# EAGLE design NSE2020_2 (EAGLE 9.6.1)
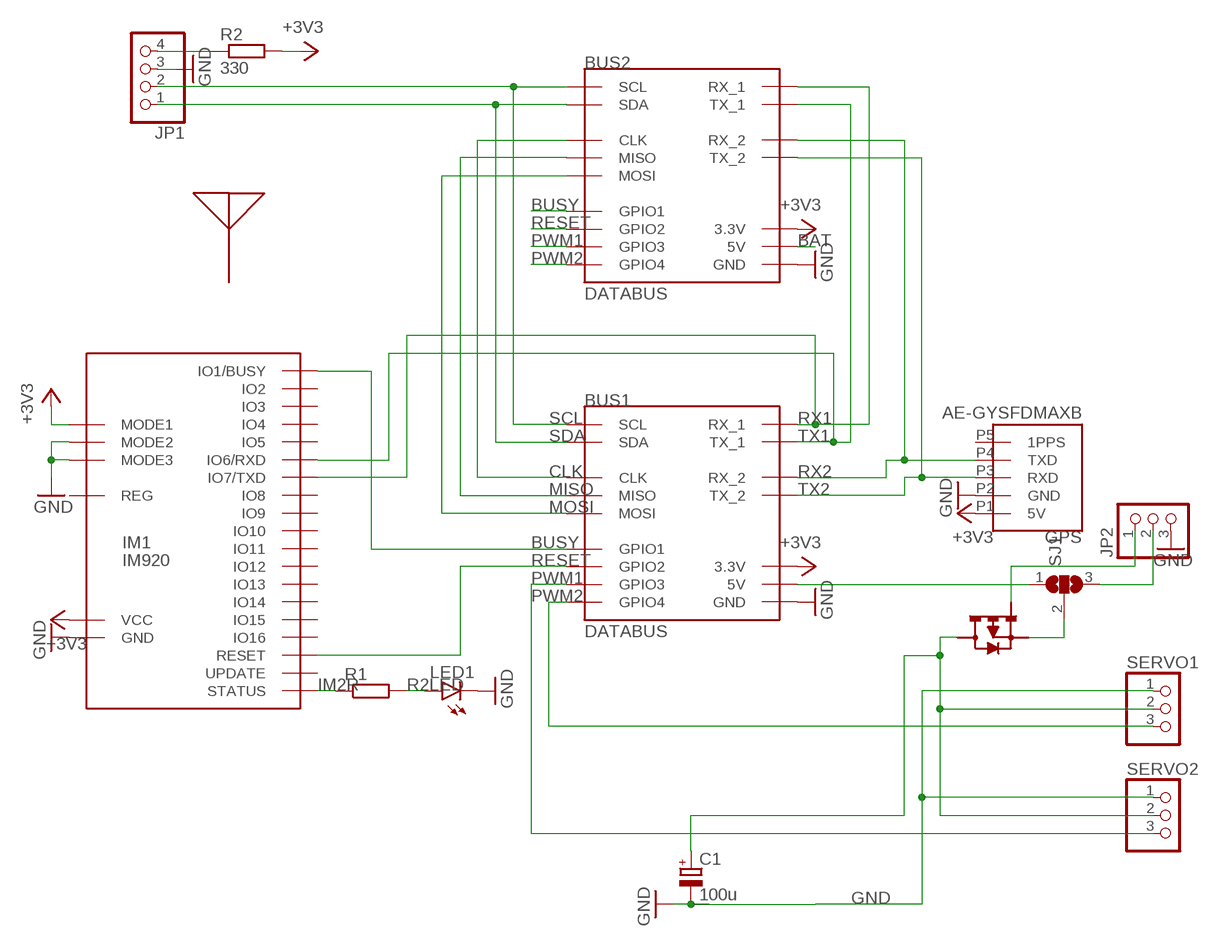
[diagram p0: schematic, sheet 1]

## Parts
ANT1  IM920ANT-XS  [ANTENNA]
BUS1  DATABUS  [8X2]
BUS2  DATABUS  [8X2]
C1  100u  CPOL-EUE2.5-6  [E2,5-6]
GPS  AE-GYSFDMAXB  [AE-GYSFDMAXB]
IM1  IM920  [IM920]
JP1  PINHD-1X4  [1X04]
JP2  PINHD-1X3  [1X03]
LED1  LEDSMT1206  [1206]
R1  R-EU_M2012  [M2012]
R2  330  R-EU_R2012  [R2012]
SERVO1  PINHD-1X3  [1X03]
SERVO2  PINHD-1X3  [1X03]
SJ1  SJ2W  [SJ_2]
U$1  2SJ681  [2SJ681]

## Nets
5V_CELL [PWR]: BUS1.P7(5V) SJ1.1
+3V3 [PWR]: BUS1.P6(3.3V) BUS2.P6(3.3V) GPS.P1(5V) IM1.IO17(MODE1) IM1.IO23(VCC) R2.2
BAT [PWR]: BUS2.P7(5V) C1.+ SERVO1.2 SERVO2.2 U$1.P$2 U$1.P$4
BAT_CELL [PWR]: JP2.2 SJ1.3
BUSY [SGNAL]: BUS1.P3(GPIO1) BUS2.P3(GPIO1) IM1.IO1(IO1/BUSY)
CLK [SGNAL]: BUS1.P1(CLK) BUS2.P1(CLK)
GND [GND]: BUS1.P11(GND) BUS2.P11(GND) C1.- GPS.P2(GND) IM1.IO18(MODE2) IM1.IO19(MODE3) IM1.IO24(GND) JP1.3 JP2.3 LED1.C SERVO1.1 SERVO2.1
IM2R [SGNAL]: IM1.IO21(STATUS) R1.1
MISO [SGNAL]: BUS1.P12(MISO) BUS2.P12(MISO)
MOSI [SGNAL]: BUS1.P2(MOSI) BUS2.P2(MOSI)
N$1 [PWR]: SJ1.2 U$1.P$3
N$2: JP2.1 U$1.P$1
PWM1 [SGNAL]: BUS1.P14(GPIO3) BUS2.P14(GPIO3) SERVO2.3
PWM2 [SGNAL]: BUS1.P15(GPIO4) BUS2.P15(GPIO4) SERVO1.3
R2BMP [PWR]: JP1.4 R2.1
R2LED [SGNAL]: LED1.A R1.2
RESET [SGNAL]: BUS1.P10(GPIO2) BUS2.P10(GPIO2) IM1.IO25(RESET)
RX1 [SGNAL]: BUS1.P4(RX_1) BUS2.P4(RX_1) IM1.IO7(IO7/TXD)
RX2 [SGNAL]: BUS1.P9(RX_2) BUS2.P9(RX_2) GPS.P4(TXD)
SCL [SGNAL]: BUS1.P0(SCL) BUS2.P0(SCL) JP1.2
SDA [SGNAL]: BUS1.P13(SDA) BUS2.P13(SDA) JP1.1
TX1 [SGNAL]: BUS1.P5(TX_1) BUS2.P5(TX_1) IM1.IO6(IO6/RXD)
TX2 [SGNAL]: BUS1.P8(TX_2) BUS2.P8(TX_2) GPS.P3(RXD)
Unconnected: GPS.P5(1PPS) IM1.IO2 IM1.IO3 IM1.IO4 IM1.IO5 IM1.IO8 IM1.IO9 IM1.IO10 IM1.IO11 IM1.IO12 IM1.IO13 IM1.IO14 IM1.IO15 IM1.IO16 IM1.IO20(UPDATE) IM1.IO22(REG)

## Library data of the parts
ANT1 = IM920ANT-XS:IM920ANT-XS
BUS1 BUS2 = databus:DATABUS
C1 = rcl:CPOL-EU: POLARIZED CAPACITOR, European symbol; SPICEPREFIX: C
GPS = AE-GYSFDMAXB:AE-GYSFDMAXB
IM1 = IM920:IM920
JP1 = pinhead:PINHD-1X4: PIN HEADER
JP2 SERVO1 SERVO2 = pinhead:PINHD-1X3: PIN HEADER
LED1 = led:LED: LED OSRAM: - CHIPLED LG R971, LG N971, LY N971, LG Q971, LY Q971, LO R971, LY R971 LH N974, LH R974 LS Q976, LO Q976, LY Q976 LO Q996 - Hyper CHIPLED LW Q18S LB Q993, LB Q99A, LB R99A - SideLED LS A670, LO A670, LY A670, LG A670, LP A670 LB A673, LV A673, LT A673, LW A673 LH A674 LY A675 LS A676, LA A676, LO A676, LY A676, LW A676 LS A679, LY A679, LG A679 - Hyper Micro SIDELED® LS Y876, LA Y876, LO Y876, LY Y876 LT Y87S - SmartLED LW L88C, LW L88S LB L89C, LB L89S, LG L890 LS L89K, LO L89K, LY L89K LS L896, LA L896, LO L896, LY L896 - TOPLED LS T670, LO T670, LY T670, LG T670, LP T670 LSG T670, LSP T670, LSY T670, LOP T670, LYG T670 LG T671, LOG T671, LSG T671 LB T673, LV T673, LT T673, LW T673 LH T674 LS T676, LA T676, LO T676, LY T676, LB T676, LH T676, LSB T676, LW T676 LB T67C, LV T67C, LT T67C, LS T67K, LO T67K, LY T67K, LW E67C LS E67B, LA E67B, LO E67B, LY E67B, LB E67C, LV E67C, LT E67C LW T67C LS T679, LY T679, LG T679 LS T770, LO T770, LY T770, LG T770, LP T770 LB T773, LV T773, LT T773, LW T773 LH T774 LS E675, LA E675, LY E675, LS T675 LS T776, LA T776, LO T776, LY T776, LB T776 LHGB T686 LT T68C, LB T68C - Hyper Mini TOPLED® LB M676 - Mini TOPLED Santana® LG M470 LS M47K, LO M47K, LY M47K Source: http://www.osram.convergy.de LUXEON: - LUMILED® LXK2-PW12-R00, LXK2-PW12-S00, LXK2-PW14-U00, LXK2-PW14-V00 LXK2-PM12-R00, LXK2-PM12-S00, LXK2-PM14-U00 LXK2-PE12-Q00, LXK2-PE12-R00, LXK2-PE12-S00, LXK2-PE14-T00, LXK2-PE14-U00 LXK2-PB12-K00, LXK2-PB12-L00, LXK2-PB12-M00, LXK2-PB14-N00, LXK2-PB14-P00, LXK2-PB14-Q00 LXK2-PR12-L00, LXK2-PR12-M00, LXK2-PR14-Q00, LXK2-PR14-R00 LXK2-PD12-Q00, LXK2-PD12-R00, LXK2-PD12-S00 LXK2-PH12-R00, LXK2-PH12-S00 LXK2-PL12-P00, LXK2-PL12-Q00, LXK2-PL12-R00 Source: www.luxeon.com KINGBRIGHT: KA-3528ASYC Source: www.kingbright.com
R1 R2 = rcl:R-EU_: RESISTOR, European symbol; SPICEPREFIX: R
SJ1 = jumper:SJ2W: SMD solder JUMPER
U$1 = 2SJ681:2SJ681

## Net classes
1 GND: width 0.635 mm, drill 0.305 mm, clearance 0.152 mm
2 PWR: width 0.635 mm, drill 0.305 mm, clearance 0.152 mm
3 SGNAL: width 0.229 mm, drill 0.305 mm, clearance 0.152 mm

## Board
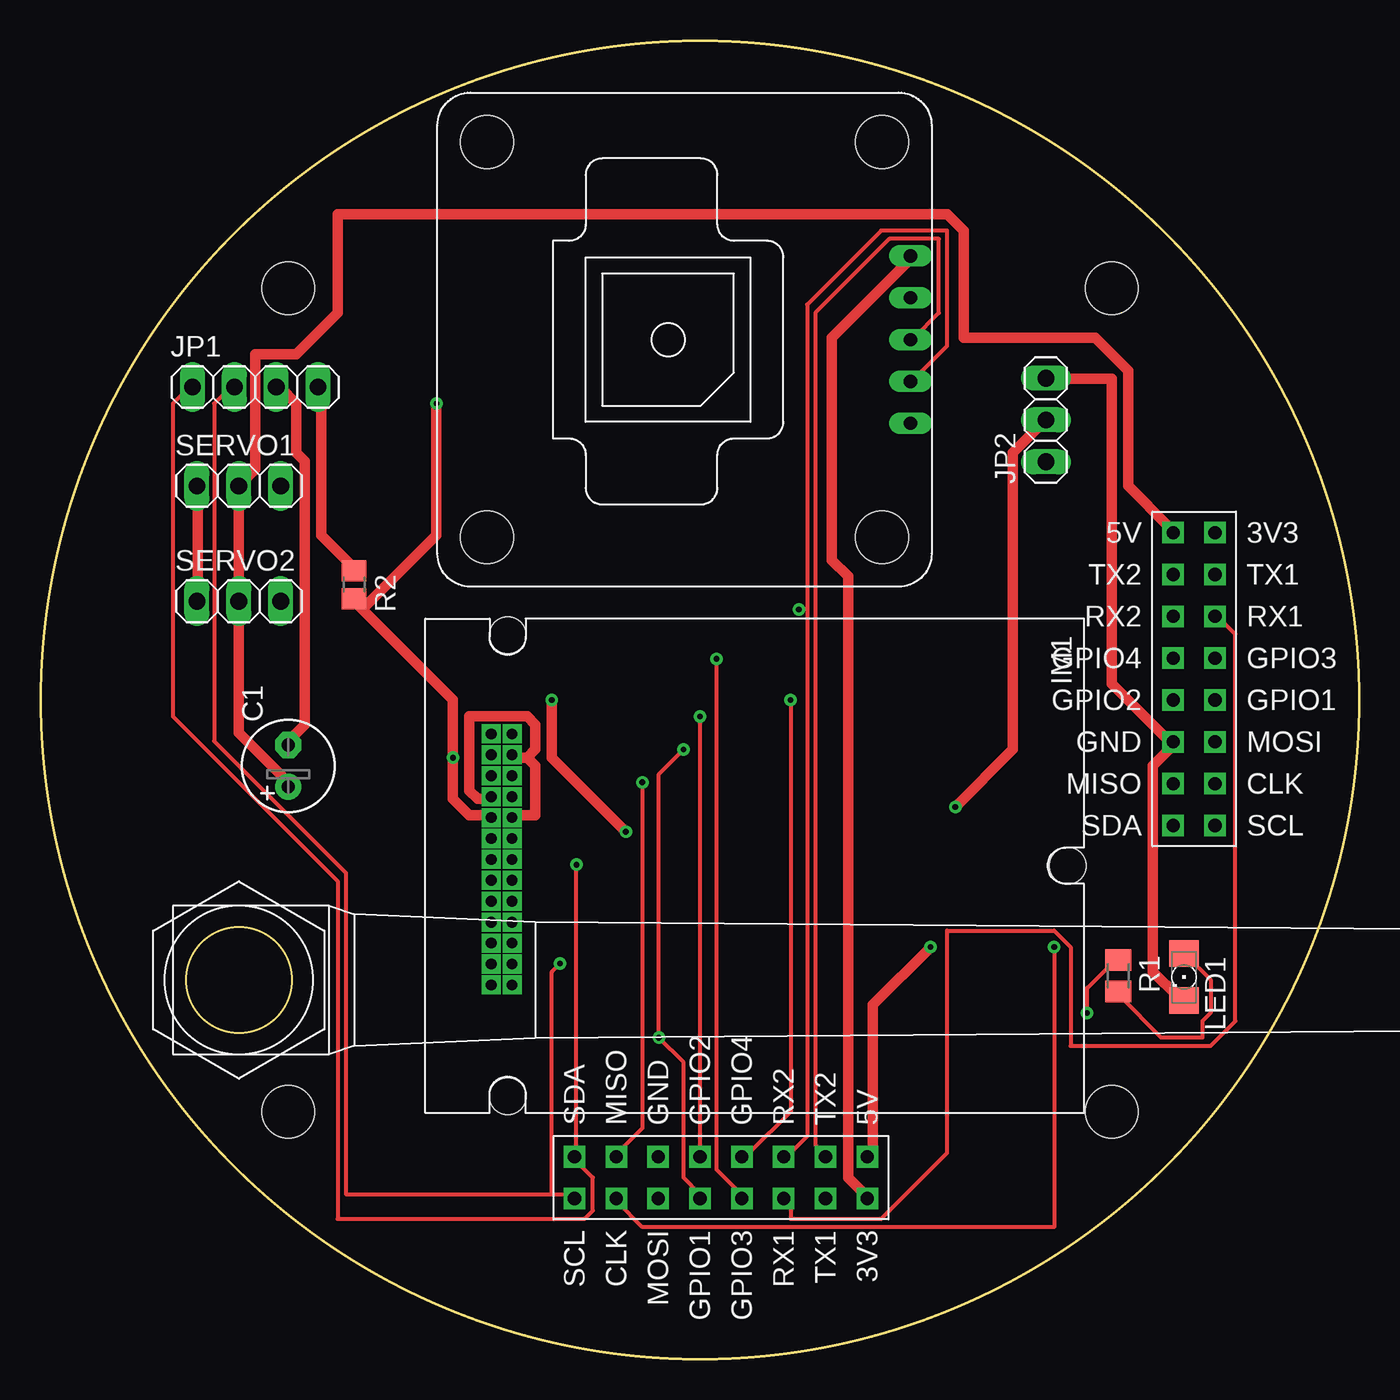
[diagram p1: board, top side]
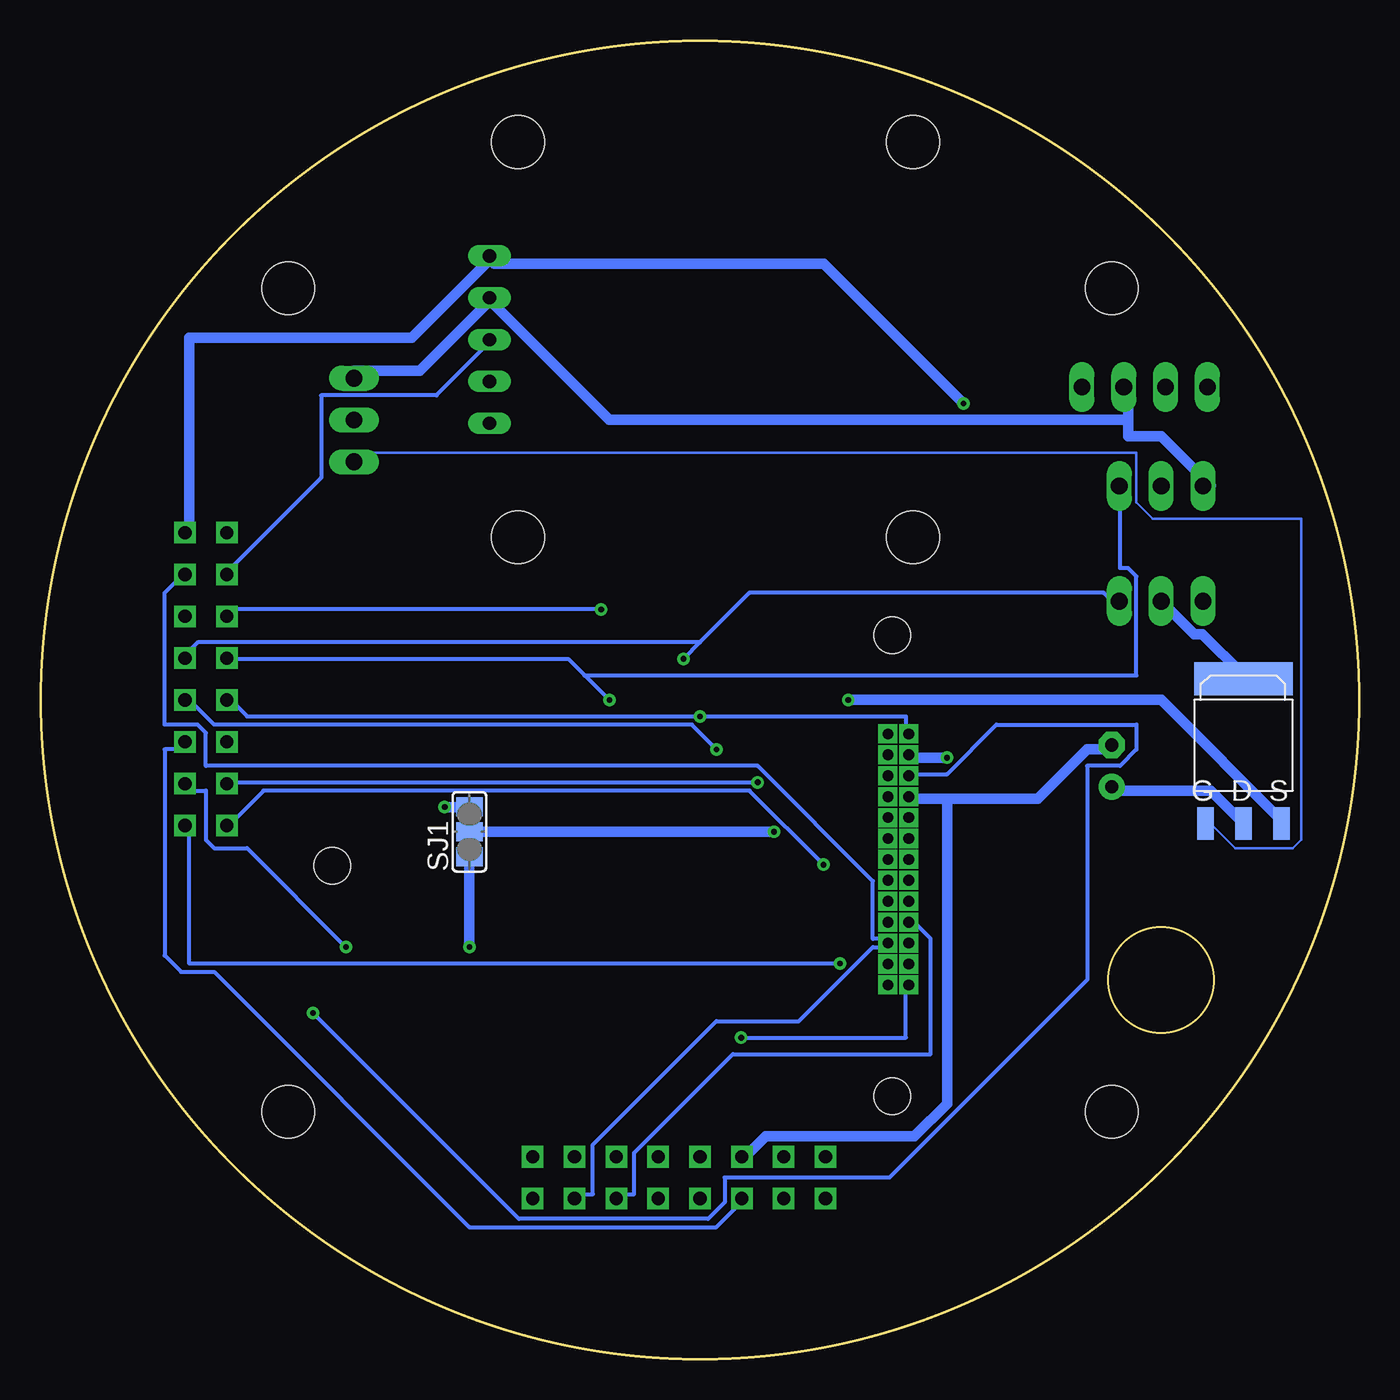
[diagram p2: board, bottom side, seen from below]

Size 80 x 80 mm. Coordinates in mm from the lower left corner, seen from the top.
Outline: circle at 40,40 radius 40
Copper layers (1*16): Top 0.035mm / dielectric 1.5mm / Bottom 0.035mm
Design rules "default": minimum track width 6mil, minimum drill 0.35mm, track to track 6mil, track to pad 6mil, pad to pad 6mil, via to via 6mil, smd to smd 6mil, copper to edge 40mil, drill to drill 6mil, minimum pad ring 10mil, minimum via ring 8mil, stop-mask expansion 4mil, vias tented up to drill 0mil, thermal gap 10mil
Holes 3.2 mm at 15,15 65,15 65,65 15,65

### Footprints (pad centres in the part's own frame; a part is rotated, then mirrored left to right if it is on the bottom)
8X2 = drill 0.8 square: P0 -1.27,7.62; P1 -1.27,5.08; P2 -1.27,2.54; P3 -1.27,0; P4 -1.27,-5.08; P5 -1.27,-7.62; P6 -1.27,-10.16; P7 1.27,-10.16; P8 1.27,-7.62; P9 1.27,-5.08; P10 1.27,0; P11 1.27,2.54; P12 1.27,5.08; P13 1.27,7.62; P14 -1.27,-2.54; P15 1.27,-2.54
E2,5-6 = drill 0.813 pad 1.6: + -1.27,0 | drill 0.813 pad 1.6 octagon: - 1.27,0
AE-GYSFDMAXB = drill 0.8 long: P1 13.716,5.08; P2 13.716,2.54; P3 13.716,0; P4 13.716,-2.54; P5 13.716,-5.08 | hole 3.2: -12,12; 12,12; 12,-12; -12,-12
IM920 = drill 0.65 square: IO1 7.24,-16; IO2 7.24,-14.73; IO3 5.97,-16; IO4 5.97,-14.73; IO5 4.7,-16; IO6 4.7,-14.73; IO7 3.43,-16; IO8 3.43,-14.73; IO9 2.16,-16; IO10 2.16,-14.73; IO11 0.89,-16; IO12 0.89,-14.73; IO13 -0.38,-16; IO14 -0.38,-14.73; IO15 -1.65,-16; IO16 -1.65,-14.73; IO17 -2.92,-16; IO18 -2.92,-14.73; IO19 -4.19,-16; IO20 -4.19,-14.73; IO21 -5.46,-16; IO22 -5.46,-14.73; IO23 -6.73,-16; IO24 -6.73,-14.73; IO25 -8,-16; IO26 -8,-14.73 | hole 2.2: -14,-15; 14,-15; 0,19
1X04 = drill 1.016 long: 1 -3.81,0; 2 -1.27,0; 3 1.27,0; 4 3.81,0
1X03 = drill 1.016 long: 1 -2.54,0; 2 0,0; 3 2.54,0
1206 = smd 1.6 x 1.803: A -1.422,0; C 1.422,0
M2012 = smd 1.3 x 1.6: 1 -0.95,0; 2 0.95,0
R2012 = smd 1.3 x 1.5: 1 -0.85,0; 2 0.85,0
SJ_2 = smd 1.168 x 1.6: 1 -1.524,0; 2 0,0; 3 1.524,0
2SJ681 = smd 1 x 2: P$1 -2.3,-2.5; P$2 0,-2.5; P$3 2.3,-2.5 | smd 6 x 2: P$4 0,6.3

### Placement (x,y rotation side)
ANT1  12,23 0 top
BUS1  40,11 90 top
BUS2  70,40 180 top
C1  15,36 90 top
GPS  39.06,61.88 0 top
IM1  43.32,29.94 270 top
JP1  13,59 0 top
JP2  61,57 90 top
LED1  69.39,23.18 270 top
R1  65.39,23.26 270 top
R2  19,47 270 top
SERVO1  12,53 0 top
SERVO2  12,46 0 top
SJ1  54,32 90 bottom
U$1  7,35 0 bottom

### Tracks (layer width: path | path; a pad name or v marks a point on that pad's centre or on a via)
5V_CELL  (via drill 0.35)
  Top 0.635: v54,25 50.5,21.5 50.5,12.5 BUS1.P7
  Bottom 0.635: v54,25 SJ1.1
+3V3  (via drill 0.35)
  Top 0.635: 19.5,45.5 25,40 v25,36.5 25,34 26,33 27,33 IM1.IO17 | 19.5,45.5 19,46 R2.2 | BUS1.P6 50,10 49,11 49,47.5 48,48.5 48,62 52.5,66.5 GPS.P1 | 19.5,45.5 24,50 v24,58
  Bottom 0.635: v25,36.5 27,36.5 IM1.IO23 | BUS2.P6 71,50.5 71,62 57.5,62 53,66.5 GPS.P1 52.5,66.5 32.5,66.5 v24,58
BAT
  Top 0.635: BUS2.P7 68.5,50.5 66,53 66,60 64,62 56,62 56,68.5 55,69.5 18,69.5 18,63.5 15.5,61 13,61 13,54 SERVO1.2 SERVO2.2 12,38 15,35 C1.+
  Bottom 0.635: U$1.P$2 9,34.5 15,34.5 C1.+ | SERVO2.2 10,44 9.5,44 7,41.5 U$1.P$4
BAT_CELL  (via drill 0.35)
  Top 0.635: v55.5,33.5 59,37 59,55 JP2.2
  Bottom 0.635: v55.5,33.5 54,33.5 SJ1.3
BUSY  (via drill 0.35)
  Top 0.229: BUS1.P3 40,10 39,11 39,18 v37.5,19.5 37.5,35.5 v39,37
  Bottom 0.229: v37.5,19.5 27.5,19.5 27.5,22.5 IM1.IO1 | v39,37 40.5,38.5 69.5,38.5 71,40 BUS2.P3
CLK  (via drill 0.35)
  Top 0.229: v61.5,25 61.5,8 36.5,8 35,9.5 BUS1.P1
  Bottom 0.229: v61.5,25 67.5,31 69.5,31 70,31.5 70,34.5 71,34.5 BUS2.P1
GND
  Top 0.635: LED1.C 69,22 67.5,23.5 67.5,36 68.5,37 BUS2.P11 68.5,37.5 65,41 65,59.5 61,59.5 JP2.3 | SERVO2.1 9.5,46 9.5,53 SERVO1.1 | 29.5,36.5 30,36 30,33 29,33 IM1.IO18 | 29.5,36.5 29,36.5 IM1.IO24 | 29.5,36.5 30,37 30,38.5 29.5,39 26,39 26,34.5 26.5,34 27,34 IM1.IO19 | JP1.3 14.5,59 15.5,58 15.5,55 16,54.5 16,38.5 15,37.5 C1.-
  Bottom 0.635: JP2.3 61,60 57,60 53,64 GPS.P2 52.5,64 45.5,57 14,57 | 14,57 14,56 12,56 9,53 SERVO1.1 | 14,57 14,59 JP1.3 | 25,34 19.5,34 16.5,37 15,37 C1.- | 25,34 27,34 IM1.IO19 | 25,34 25,15.5 27,13.5 36,13.5 37,12.5 BUS1.P11
IM2R  (via drill 0.35)
  Top 0.229: v63.5,21 63.5,22.5 65,24 R1.1
  Bottom 0.229: v63.5,21 51,8.5 39.5,8.5 38.5,9.5 38.5,11 28.5,11 16.5,23 16.5,36 14.5,36 13.5,37 13.5,38.5 22,38.5 25,35.5 27,35.5 IM1.IO21
MISO  (via drill 0.35)
  Top 0.229: v36.5,35 36.5,14 35,12.5 BUS1.P12
  Bottom 0.229: v36.5,35 68.5,35 BUS2.P12
MOSI
  Bottom 0.229: BUS1.P2 37.5,9.5 39,8 54,8 69.5,23.5 71.5,23.5 72.5,24.5 72.5,37 71.5,37 BUS2.P2
N$1  (via drill 0.35)
  Top 0.635: v35.5,32 31,36.5 v31,40
  Bottom 0.635: v35.5,32 SJ1.2 | v31,40 12,40 4.5,32.5 U$1.P$3
N$2
  Bottom 0.152: U$1.P$1 9,32.5 7.5,31 4,31 3.5,31.5 3.5,51 12.5,51 13.5,52 13.5,55 60.5,55 61,54.5 JP2.1
PWM1  (via drill 0.35)
  Top 0.229: v41,42.5 41,11.5 42.5,10 BUS1.P14
  Bottom 0.229: 40,43.5 37,46.5 15.5,46.5 15,46 SERVO2.3 | 40,43.5 v41,42.5 | 40,43.5 70.5,43.5 71,43 BUS2.P14
PWM2  (via drill 0.35)
  Top 0.229: v45.5,40 45.5,15 43,12.5 BUS1.P15
  Bottom 0.229: 47,41.5 48,42.5 68.5,42.5 BUS2.P15 | 47,41.5 v45.5,40 | 47,41.5 13.5,41.5 13.5,47.5 14,48 14.5,48 14.5,53 SERVO1.3
R2BMP
  Top 0.635: R2.1 19,48 17,50 17,59 JP1.4
R2LED
  Top 0.229: R1.2 65.5,22 68,19.5 70.5,19.5 70.5,20.5 71,21 71,23 69.5,24.5 LED1.A
RESET  (via drill 0.35)
  Top 0.229: v40,39 BUS1.P10
  Bottom 0.229: IM1.IO25 27.5,38 27.5,39 v40,39 67.5,39 68.5,40 BUS2.P10
RX1
  Top 0.229: BUS2.P4 71.5,45 72.5,44 72.5,20.5 71,19 62.5,19 62.5,25 61.5,26 55,26 55,12.5 51,8.5 45.5,8.5 45.5,9.5 BUS1.P4
  Bottom 0.229: IM1.IO7 27,26.5 26,25.5 26,18.5 38,18.5 44,12.5 44,10 45,10 BUS1.P4
RX2  (via drill 0.35)
  Top 0.229: 46.5,45.5 46.5,64 51,68.5 55,68.5 55,61.5 53,59.5 GPS.P4 | 46.5,45.5 46.5,13.5 45.5,12.5 BUS1.P9 | 46.5,45.5 v46,45.5
  Bottom 0.229: v46,45.5 68.5,45.5 BUS2.P9
SCL  (via drill 0.35)
  Top 0.229: 31,10 18.5,10 18.5,29.5 10.5,37.5 10.5,58 11.5,59 JP1.2 | 31,10 32,10 BUS1.P0 | v31.5,24 31,23.5 31,10
  Bottom 0.229: v31.5,24 71,24 71,32 BUS2.P0
SDA  (via drill 0.35)
  Top 0.229: JP1.1 9,59 8,58 8,39 18,29 18,8.5 33,8.5 33.5,9 33.5,11 32.5,12 BUS1.P13 32.5,12.5 v32.5,30
  Bottom 0.229: v32.5,30 37,34.5 66.5,34.5 68.5,32.5 BUS2.P13
TX1
  Bottom 0.229: BUS1.P5 47.5,10 46.5,10 46.5,13 39,20.5 34,20.5 29.5,25 29,25 IM1.IO6 29,25.5 29.5,25.5 29.5,29 36.5,36 70,36 70,38 70.5,38.5 72.5,38.5 72.5,46.5 71.5,47.5 BUS2.P5
TX2
  Top 0.229: BUS1.P8 47.5,12.5 47,13 47,63.5 51.5,68 54.5,68 54.5,63.5 53,62 GPS.P3
  Bottom 0.229: BUS2.P8 68.5,48 63,53.5 63,58.5 56,58.5 53,61.5 GPS.P3